# EAGLE design WaterLevelDisplay_v1-0 (EAGLE 9.0.1)
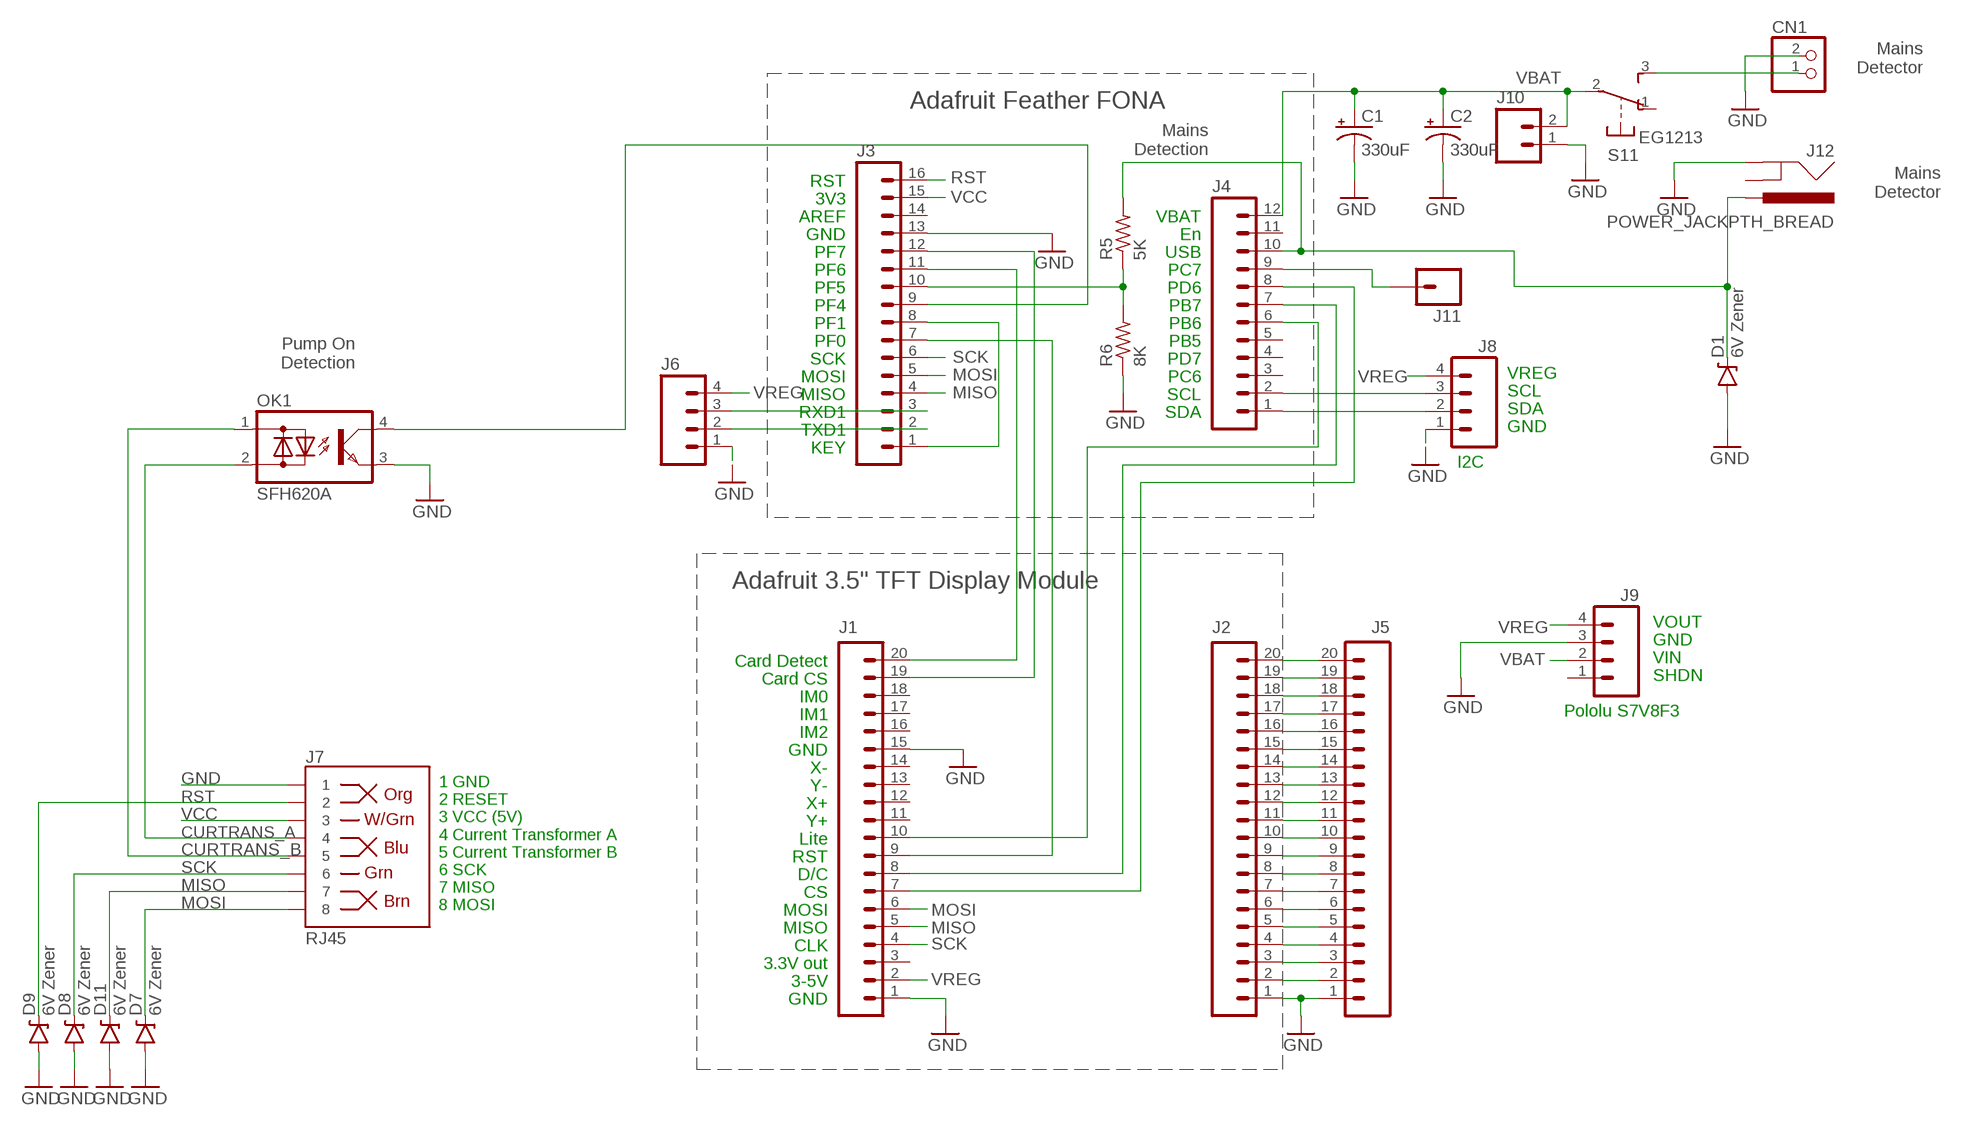
[diagram p0: schematic, sheet 1]

## Parts
C1  330uF  CAP_POLPTH1  [CPOL-RADIAL-100UF-25V]
C2  330uF  CAP_POLPTH1  [CPOL-RADIAL-100UF-25V]
CN1  JST_2PIN-SMT-RA  [JST-PH-2-SMT-RA]
D1  6V Zener  DIODE-ZENERPTH  [DIODE-ZENER]
D7  6V Zener  DIODE-ZENERPTH  [DIODE-ZENER]
D8  6V Zener  DIODE-ZENERPTH  [DIODE-ZENER]
D9  6V Zener  DIODE-ZENERPTH  [DIODE-ZENER]
D11  6V Zener  DIODE-ZENERPTH  [DIODE-ZENER]
J1  M20NOSILK  [1X20_NOSILK]
J2  M20NOSILK  [1X20_NOSILK]
J3  M161X16_NO_SILK  [1X16_NO_SILK]
J4  M12NO_SILK  [1X12_NO_SILK]
J5  M20NOSILK  [1X20_NOSILK]
J6  M04PTH  [1X04]
J7  RJ45  RJ45-8PTH  [RJ45-8]
J8  M04PTH  [1X04]
J9  M04PTH  [1X04]
J10  M02PTH  [1X02]
J11  M01PTH  [1X01]
J12  POWER_JACKPTH_BREAD  [POWER_JACK_PTH_BREAD]
OK1  SFH620A  [DIL04]
R5  5K  R-US_0204/5  [0204/5]
R6  8K  R-US_0204/5  [0204/5]
S1  EG1213  [EG1213]

## Nets
CURTRANS_A: J7.4 OK1.2(AC2)
CURTRANS_B: J7.5 OK1.1(AC1)
GND: C1.2(-) C2.2(-) CN1.2 D1.P$2(A) D7.P$2(A) D8.P$2(A) D9.P$2(A) D11.P$2(A) J1.1 J1.15 J2.1 J3.13 J5.1 J6.1 J7.1 J8.1 J9.3 J10.1 J12.GND OK1.3(E) R6.1
MISO: D11.P$1(C) J1.5 J3.4 J7.7
MOSI: D7.P$1(C) J1.6 J3.5 J7.8
N$1: CN1.1 S1.3(1:S)
N$2: J2.2 J5.2
N$3: J2.3 J5.3
N$4: J2.4 J5.4
N$5: J2.5 J5.5
N$6: J3.3 J6.3
N$7: J2.6 J5.6
N$8: J2.7 J5.7
N$9: J4.9 J11.1
N$10: J2.8 J5.8
N$11: J2.9 J5.9
N$12: J2.10 J5.10
N$13: J2.11 J5.11
N$14: J2.12 J5.12
N$15: J3.1 J3.8
N$16: J2.13 J5.13
N$17: D1.P$1(C) J4.10 J12.PWR R5.2
N$18: J3.10 R5.1 R6.2
N$19: J2.14 J5.14
N$20: J2.15 J5.15
N$21: J2.16 J5.16
N$22: J2.17 J5.17
N$23: J2.18 J5.18
N$24: J2.19 J5.19
N$25: J2.20 J5.20
N$26: J3.2 J6.2
N$27: J1.8 J4.7
N$28: J1.19 J3.12
N$29: J1.20 J3.11
N$30: J1.10 J4.6
N$31: J3.9 OK1.4(C)
N$32: J1.7 J4.8
N$33: J1.9 J3.7
N$34: J4.1 J8.2
N$35: J4.2 J8.3
RST: D9.P$1(C) J3.16 J7.2
SCK: D8.P$1(C) J1.4 J3.6 J7.6
VBAT: C1.1(+) C2.1(+) J4.12 J9.2 J10.2 S1.2(1:P)
VCC: J3.15 J7.3
VREG: J1.2 J6.4 J8.4 J9.4
Unconnected: J1.3 J1.11 J1.12 J1.13 J1.14 J1.16 J1.17 J1.18 J3.14 J4.3 J4.4 J4.5 J4.11 J9.1 J12.GNDBREAK S1.1(1:O) S1.MT1(MT) S1.MT2(MT)

## Notes on the sheet
- Mains
  Detector
- Adafruit Feather FONA
- Mains
  Detection
- RST
- Mains
  Detector
- 3V3
- AREF | VBAT
- GND | En
- PF7 | USB
- PF6 | PC7
- PF5 | PD6
- PF4 | PB7
- PF1 | PB6
- PF0 | PB5
- SCK | PD7
- Pump On
  Detection
- MOSI | PC6 | VREG
- MISO | SCL | SCL
- RXD1 | SDA | SDA
- TXD1 | GND
- KEY
- I2C
- Adafruit 3.5" TFT Display Module
- VOUT
- GND
- Card Detect | VIN
- Card CS | SHDN
- IM0
- IM1 | Pololu S7V8F3
- IM2
- GND
- X-
- 1 GND
  2 RESET
  3 VCC (5V)
  4 Current Transformer A
  5 Current Transformer B
  6 SCK
  7 MISO
  8 MOSI
- Y-
- X+
- Y+
- Lite
- RST
- D/C
- CS
- MOSI
- MISO
- CLK
- 3.3V out
- 3-5V
- GND

## Library data of the parts
C1 C2 = SparkFun-Capacitors:CAP_POL: Capacitor Polarized These are standard SMD and PTH capacitors. Normally 10uF, 47uF, and 100uF in electrolytic and tantalum varieties. Always verify the external diameter of the through hole cap, it varies with capacity, voltage, and manufacturer. The EIA devices should be standard.
CN1 = adafruit:JST_2PIN: JST 2-Pin Connectors of various flavors SMT-RA (S2B-PH-SM4) 4UConnector #17311 SMT (B2B-PH-SM4) THM-RA (S2B-PH) THM (B2B-PH)
D1 D7-D9 D11 = SparkFun-DiscreteSemi:DIODE-ZENER: Zener Diode Production Part - 8199 3.4V Zener Voltage
J1 J2 J5 = SparkFun-Connectors:M20: 1x20 .1" header This is just like the LOCK variant in that the holes are staggared by 5 mil, but except for the last two holes. They are not altered from the "standard" footprint layout. This is used for a special purpose on the layout of our Graphic LCD Backpack. Make sure you want to use this device before selecting it for you project!
J3 = SparkFun-Connectors:M16: 1x16 .1" header
J4 = SparkFun-Connectors:M12: Header 12 Standard 12-pin 0.1" header. Use with straight break away headers (SKU : PRT-00116), right angle break away headers (PRT-00553), swiss pins (PRT-00743), machine pins (PRT-00117), and female headers (PRT-00115).
J6 J8 J9 = SparkFun-Connectors:M04: Header 4 Standard 4-pin 0.1" header. Use with straight break away headers (SKU : PRT-00116), right angle break away headers (PRT-00553), swiss pins (PRT-00743), machine pins (PRT-00117), and female headers (PRT-00115). Molex polarized connector foot print use with SKU : PRT-08231 with associated crimp pins and housings. 1MM SMD Version SKU: PRT-10208; PROD_ID: CONN-09696
J7 = SparkFun-Connectors:RJ45-8: RJ45 Jack Simple RJ45, 8-pin connection - connector for common Cat5, Cat5e, and Cat6 Ethernet cables. Footprint not yet proven in production. Connector sku is PRT-00643; Breakout PCB sku is BOB-00716.; PROD_ID: CONN-08506
J10 = SparkFun-Connectors:M02: Standard 2-pin 0.1" header. Use with - straight break away headers ( PRT-00116) - right angle break away headers (PRT-00553) - swiss pins (PRT-00743) - machine pins (PRT-00117) - female headers (PRT-00115) Molex polarized connector foot print use with: PRT-08233 with associated crimp pins and housings. 2.54_SCREWTERM for use with PRT-10571. 3.5mm Screw Terminal footprints for PRT-08084 5mm Screw Terminal footprints for use with PRT-08432
J11 = SparkFun-Connectors:M01: Header 1 Standard 1-pin 0.1" header. Use with straight break away headers (SKU : PRT-00116), right angle break away headers (PRT-00553), swiss pins (PRT-00743), machine pins (PRT-00117), and female headers (PRT-00115). SMTSO-256-ET is a "flush mount" nut for a 4-40 screw. The older package used to be too tight, and did not allow it to sit properly thru the drill hit. The latest (0.165DIA) fits nice and snug.
J12 = SparkFun-Connectors:POWER_JACK: Power Jack This is the standard 5.5mm barrel jack for power. The PTH is the most common, proven, reliable, footprint. The Slot footprint only works if the mill layer is transmitted to the PCB fab house so be warned. Mating wall wart : TOL-00298 (and others); PROD_ID: PRT-10811
OK1 = optocoupler:SFH620: Optocoupler, Phototransistor Output, AC Input Source: http://www.vishay.com/docs/83675/sfh620.pdf; MPN: SFH620A-2; OC_FARNELL: 1469594; OC_NEWARK: 97K9546
R5 R6 = resistor:R-US_: RESISTOR, American symbol
S1 = adafruit:EG1213: E-Switch right-angle slide SPDT Part #EG1213 http://www.ladyada.net/library/eagle

## Board
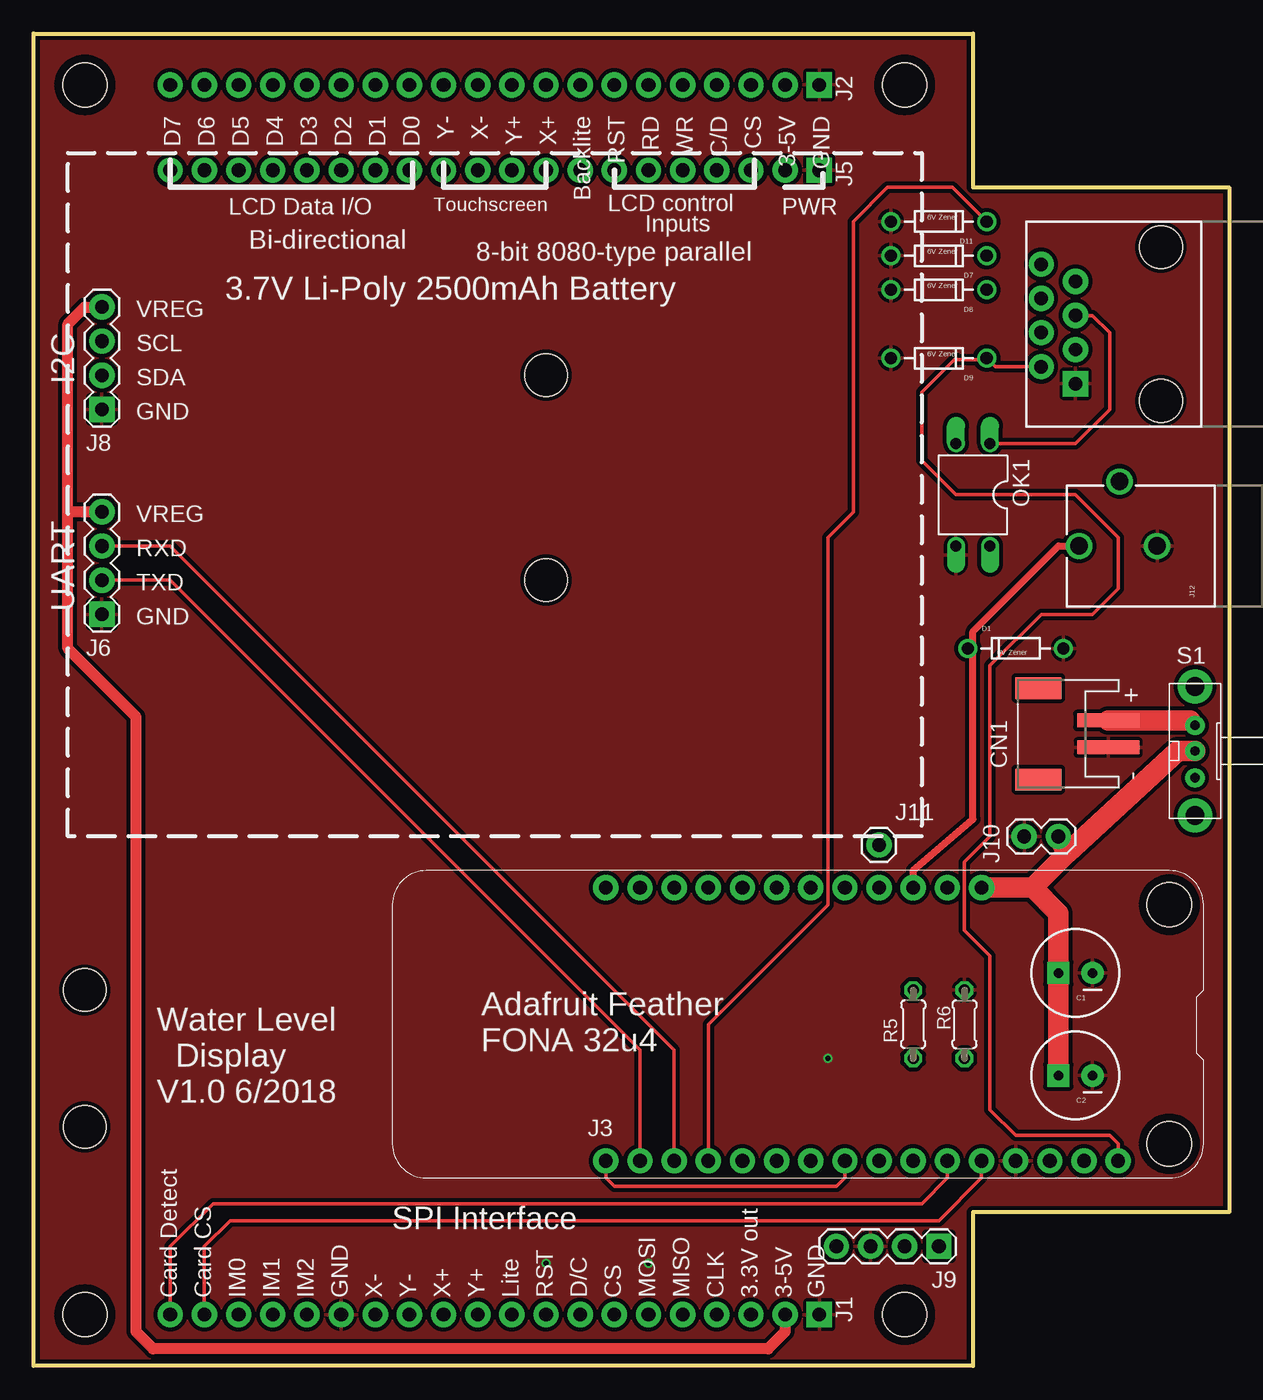
[diagram p1: board, top side]
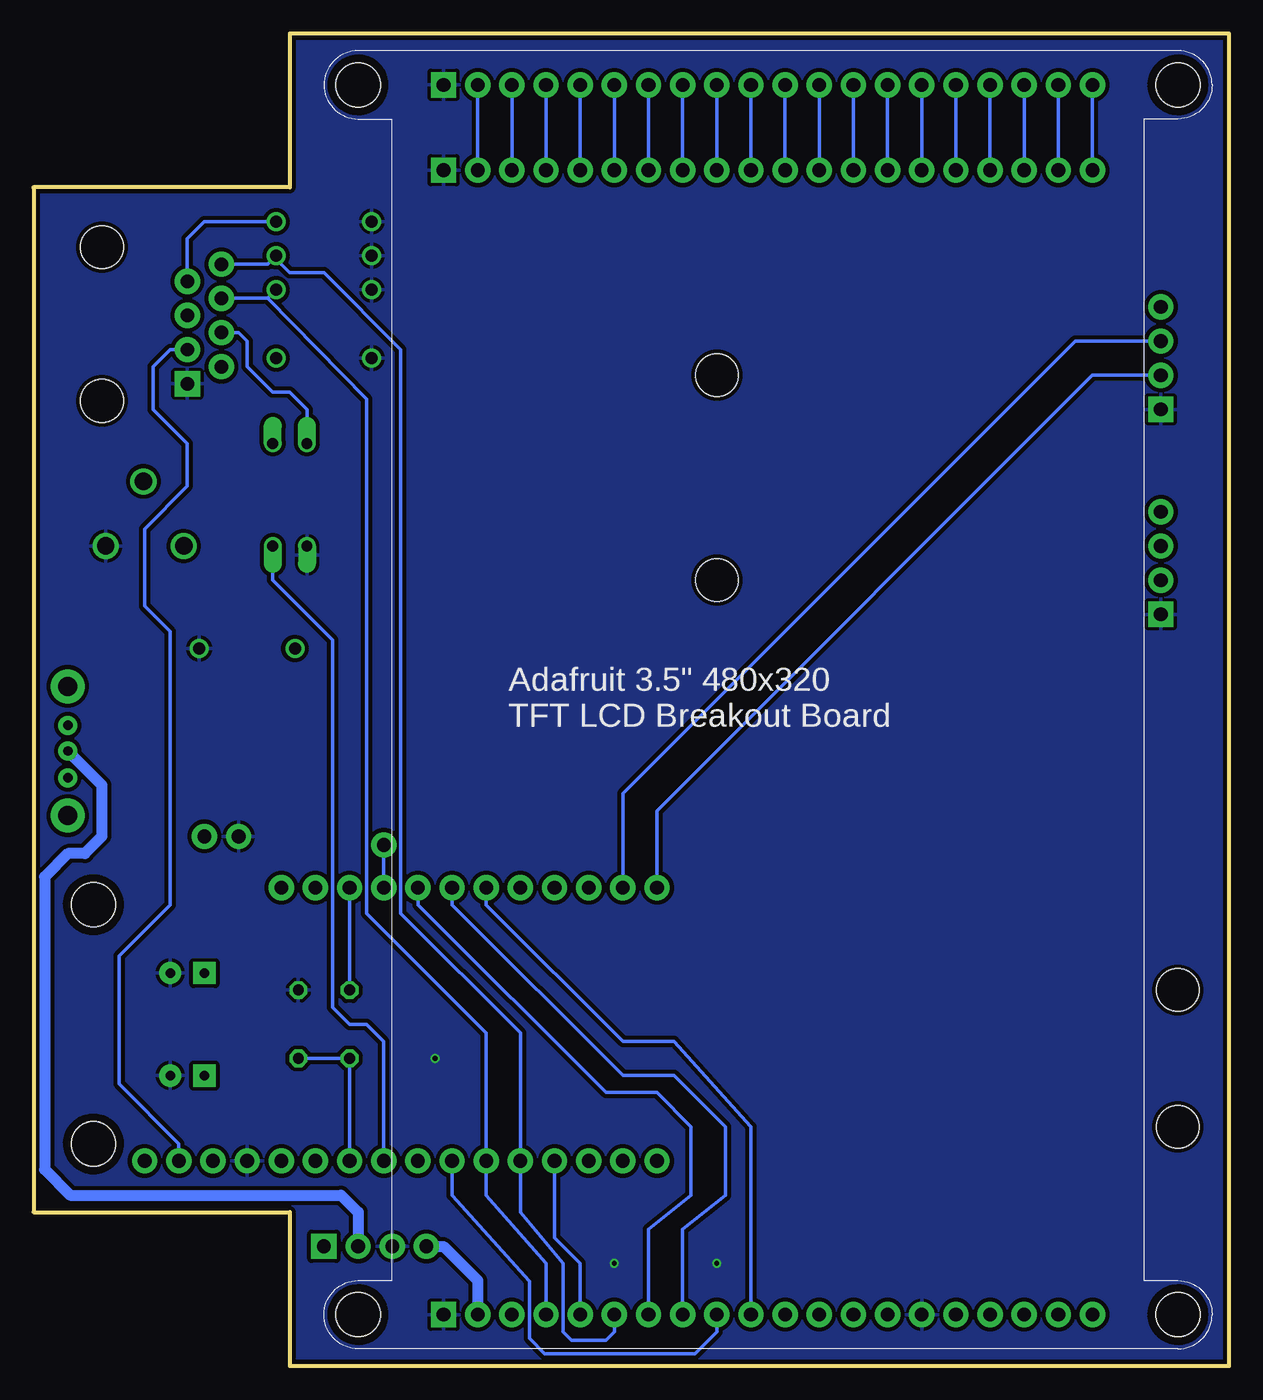
[diagram p2: board, bottom side, seen from below]

Size 88.9 x 99.06 mm. Coordinates in mm from the lower left corner, seen from the top.
Outline: 0,99.06 69.85,99.06 69.85,87.63 88.9,87.63 88.9,11.43 69.85,11.43 69.85,0 0,0 0,99.06
Copper layers (1*16): Top 0.035mm / dielectric 1.5mm / Bottom 0.035mm
Design rules "SeeedStudio_2layer_DRU_no_angle_20140221": minimum track width 6mil, minimum drill 12mil, track to track 6mil, track to pad 6mil, pad to pad 6mil, via to via 6mil, smd to smd 0mil, copper to edge 10mil, drill to drill 10mil, minimum pad ring 10mil, minimum via ring 6mil, stop-mask expansion 2mil, vias tented up to drill 100mil, thermal gap 10mil
Holes 3.17 mm at 3.81,27.94 3.81,17.78 38.1,73.66 38.1,58.42

### Footprints (pad centres in the part's own frame; a part is rotated, then mirrored left to right if it is on the bottom)
CPOL-RADIAL-100UF-25V = drill 0.7 pad 1.651 square: 1 1.27,0 | drill 0.7 pad 1.651: 2 -1.27,0
JST-PH-2-SMT-RA = smd 1 x 4.6: 1 1,-3.7; 2 -1,-3.7 | smd 1.6 x 3.4: NC1 -3.4,1.5; NC2 3.4,1.5
DIODE-ZENER = drill 0.9: P$1 -3.556,0; P$2 3.556,0
1X20_NOSILK = drill 1.016 pad 1.88 square: 1 0,0 | drill 1.016 pad 1.88: 2 2.54,0; 3 5.08,0; 4 7.62,0; 5 10.16,0; 6 12.7,0; 7 15.24,0; 8 17.78,0; 9 20.32,0; 10 22.86,0; 11 25.4,0; 12 27.94,0; 13 30.48,0; 14 33.02,0; 15 35.56,0; 16 38.1,0; 17 40.64,0; 18 43.18,0; 19 45.72,0; 20 48.26,0
1X16_NO_SILK = drill 1.016 pad 1.88: 1 0,0; 2 2.54,0; 3 5.08,0; 4 7.62,0; 5 10.16,0; 6 12.7,0; 7 15.24,0; 8 17.78,0; 9 20.32,0; 10 22.86,0; 11 25.4,0; 12 27.94,0; 13 30.48,0; 14 33.02,0; 15 35.56,0; 16 38.1,0
1X12_NO_SILK = drill 1.016 pad 1.88: 1 0,0; 2 2.54,0; 3 5.08,0; 4 7.62,0; 5 10.16,0; 6 12.7,0; 7 15.24,0; 8 17.78,0; 9 20.32,0; 10 22.86,0; 11 25.4,0; 12 27.94,0
1X04 = drill 1.016 pad 1.88 square: 1 0,0 | drill 1.016 pad 1.88: 2 2.54,0; 3 5.08,0; 4 7.62,0
RJ45-8 = drill 1 pad 1.88 square: 1 -4.445,6.35 | drill 1 pad 1.88: 2 -3.175,8.89; 3 -1.905,6.35; 4 -0.635,8.89; 5 0.635,6.35; 6 1.905,8.89; 7 3.175,6.35; 8 4.445,8.89 | hole 3.2: -5.715,0; 5.715,0
1X02 = drill 1.016 pad 1.88: 1 0,0; 2 2.54,0
1X01 = drill 1.016 pad 1.88: 1 0,0
POWER_JACK_PTH_BREAD = drill 1.3: GND 0,7.9; GNDBREAK 4.8,10.7; PWR 0,13.7
DIL04 = drill 0.813 offset: 1 -1.27,-3.81; 2 1.27,-3.81; 3 1.27,3.81; 4 -1.27,3.81
0204/5 = drill 0.813 octagon: 1 -2.54,0; 2 2.54,0
EG1213 = drill 0.7 pad 1.422: 1 -2,0; 2 0,0; 3 1.9,0 | drill 1.4 pad 2.54: MT1 -4.8,0; MT2 4.8,0
STAND-OFF = hole 3.302: 0,0

### Placement (x,y rotation side)
C1  77.47,29.21 180 top
C2  77.47,21.59 180 top
CN1  76.2,46.99 90 top
D1  73.03,53.34 0 top
D7  67.31,82.55 180 top
D8  67.31,80.01 180 top
D9  67.31,74.93 180 top
D11  67.31,85.09 180 top
J1  58.42,3.81 180 top
J2  58.42,95.25 180 top
J3  42.55,15.24 0 top
J4  42.55,35.56 0 top
J5  58.42,88.9 180 top
J6  5.08,55.88 90 top
J7  83.82,77.47 90 top
J8  5.08,71.12 90 top
J9  67.31,8.89 180 top
J10  73.66,39.37 0 top
J11  62.87,38.73 0 top
J12  91.44,60.96 90 top
OK1  69.85,64.77 180 top
R5  65.41,25.4 90 top
R6  69.22,25.4 270 top
S1  86.36,45.72 90 top
U$1  [STAND-OFF]  64.77,3.81 0 top
U$2  [STAND-OFF]  84.45,34.29 90 top
U$3  [STAND-OFF]  3.81,95.25 0 top
U$4  [STAND-OFF]  84.45,16.51 90 top
U$5  [STAND-OFF]  64.77,95.25 0 top
U$6  [STAND-OFF]  3.81,3.81 0 top

### Tracks (layer width: path | path; a pad name or v marks a point on that pad's centre or on a via)
CURTRANS_A
  Bottom 0.254: OK1.2 68.58,71.12 69.85,72.39 71.12,72.39 73.03,74.3 73.03,76.2 73.66,76.83 J7.4
CURTRANS_B
  Top 0.254: OK1.1 77.47,68.58 80.01,71.12 80.01,76.83 78.74,78.11 J7.5
GND  (via drill 0.35)
  other vias: 59.05,22.86 38.1,7.62 45.72,7.62
  pour Top (isolate 0.305): 0,99.06 69.85,99.06 69.85,87.63 88.9,87.63 88.9,11.43 69.85,11.43 69.85,0 0,0
  pour Bottom (isolate 0.305): 0,99.06 69.85,99.06 69.85,87.63 88.9,87.63 88.9,11.43 69.85,11.43 69.85,0 0,0
MISO
  Top 0.254: D11.P$1 68.33,87.63 63.5,87.63 60.96,85.09 60.96,63.5 59.05,61.59 59.05,34.29 50.16,25.4 J3.4
  Bottom 0.254: J1.5 48.26,7.62 50.16,9.53 J3.4 | D11.P$1 76.2,85.09 77.47,83.82 J7.7
MOSI
  Bottom 0.254: J1.6 45.72,2.54 46.35,1.91 48.9,1.91 49.53,2.54 49.53,7.62 52.7,11.43 J3.5 52.7,24.77 61.59,33.66 61.59,75.56 67.31,81.28 69.85,81.28 70.87,82.3 D7.P$1 71.5,81.92 J7.8
N$1
  Top 1.27: 85.99,47.99 S1.3
  Top 1.524: CN1.1 85.99,47.99
N$2
  Bottom 0.254: J2.2 J5.2
N$3
  Bottom 0.254: J2.3 J5.3
N$4
  Bottom 0.254: J2.4 J5.4
N$5
  Bottom 0.254: J2.5 J5.5
N$6
  Top 0.254: J6.3 10.16,60.96 47.62,23.5 J3.3
N$7
  Bottom 0.254: J2.6 J5.6
N$8
  Bottom 0.254: J2.7 J5.7
N$9
  Bottom 0.254: J11.1 J4.9
N$10
  Bottom 0.254: J2.8 J5.8
N$11
  Bottom 0.254: J2.9 J5.9
N$12
  Bottom 0.254: J2.10 J5.10
N$13
  Bottom 0.254: J2.11 J5.11
N$14
  Bottom 0.254: J2.12 J5.12
N$15
  Top 0.254: J3.1 42.55,13.97 43.18,13.34 59.69,13.34 60.33,13.97 J3.8
N$16
  Bottom 0.254: J2.13 J5.13
N$17
  Top 0.508: J4.10 65.41,36.83 69.85,40.64 69.85,53.34 | 69.85,53.34 69.85,54.61 76.2,60.96 J12.PWR | D1.P$1 69.85,53.34
  Bottom 0.254: R5.2 J4.10
N$18
  Bottom 0.254: R6.2 R5.1 J3.10
N$19
  Bottom 0.254: J2.14 J5.14
N$20
  Bottom 0.254: J2.15 J5.15
N$21
  Bottom 0.254: J2.16 J5.16
N$22
  Bottom 0.254: J2.17 J5.17
N$23
  Bottom 0.254: J2.18 J5.18
N$24
  Bottom 0.254: J2.19 J5.19
N$25
  Bottom 0.254: J2.20 J5.20
N$26
  Top 0.254: J6.2 10.16,58.42 45.09,23.5 J3.2
N$27
  Bottom 0.254: J4.7 57.78,34.29 45.09,21.59 41.27,21.59 37.47,17.78 37.47,12.7 40.64,10.16 J1.8
N$28
  Top 0.254: J3.12 70.48,13.97 67.31,10.79 14.61,10.79 12.7,8.89 J1.19
N$29
  Top 0.254: J3.11 67.94,13.97 66.04,12.06 13.34,12.06 10.16,8.89 J1.20
N$30
  Bottom 0.254: J1.10 35.56,17.78 41.27,24.13 45.09,24.13 55.24,34.29 J4.6
N$31
  Bottom 0.254: J3.9 62.87,24.13 64.14,25.4 65.41,25.4 66.67,26.67 66.67,53.98 71.12,58.42 OK1.4
N$32
  Bottom 0.254: J1.7 43.18,10.16 40.01,12.7 40.01,17.78 42.55,20.32 46.35,20.32 60.33,34.29 J4.8
N$33
  Bottom 0.254: J3.7 57.78,12.7 52.02,6.3 52.02,2.04 50.9,0.91 39.73,0.91 38.1,2.54 J1.9
N$34
  Bottom 0.254: J8.2 10.16,73.66 42.55,41.27 J4.1
N$35
  Bottom 0.254: J8.3 11.43,76.2 45.09,42.55 J4.2
RST
  Top 0.254: J7.2 71.5,74.3 70.99,74.8 | 70.99,74.8 D9.P$1 | 70.99,74.8 68.71,74.8 68.58,74.93 66.04,72.39 66.04,67.31 68.58,64.77 77.47,64.77 80.64,61.59 80.64,57.78 78.74,55.88 74.93,55.88 71.12,52.07 71.12,39.37 69.22,37.47 69.22,32.38 71.12,30.48 71.12,19.05 73.03,17.14 80.01,17.14 80.64,16.51 J3.16
SCK
  Bottom 0.254: J1.4 50.8,7.62 55.24,12.7 J3.6 55.24,24.77 64.14,33.66 64.14,71.87 71.5,79.38 | 70.87,79.76 D8.P$1 71.5,79.38 | 71.5,79.38 J7.6
VBAT
  Top 1.524: S1.2 85.09,45.72 76.83,38.1 | 76.83,38.1 74.3,35.56 | 74.3,35.56 J4.12 | J10.2 76.83,38.1 | C2.1 C1.1 76.2,33.66 74.3,35.56
  Bottom 0.813: S1.2 83.82,43.18 83.82,39.37 85.09,38.1 86.36,38.1 88.09,36.37 88.09,14.61 86.18,12.7 66.04,12.7 64.77,11.43 J9.2
VCC
  Bottom 0.254: J7.3 78.74,75.56 80.01,74.3 80.01,71.12 77.47,68.58 77.47,65.41 80.64,62.23 80.64,56.52 78.74,54.61 78.74,34.29 82.55,30.48 82.55,20.95 78.11,16.51 J3.15
VREG
  Top 0.813: J1.2 55.88,2.54 54.61,1.27 8.89,1.27 7.62,2.54 7.62,48.26 2.54,53.34 2.54,63.5 | 2.54,63.5 2.54,77.47 3.81,78.74 J8.4 | J6.4 2.54,63.5
  Bottom 0.813: J9.4 58.42,8.89 55.88,6.35 J1.2

### Text on the board
tPlace: D7 | D6 | D5 | D4 | D3 | D2 | D1 | D0 | Y- | X- | Y+ | X+ | Backlite | RST | RD | WR | C/D | CS | 3-5V | GND | LCD Data I/O | Touchscreen | LCD control | PWR | Inputs | Bi-directional | 8-bit 8080-type parallel | 3.7V Li-Poly 2500mAh Battery | VREG | I2C | SCL | SDA | GND | UART | VREG | RXD | TXD | GND | Adafruit Feather / FONA 32u4 | Water Level / Display / V1.0 6/2018 | SPI Interface | Card Detect | Card CS | IM0 | IM1 | IM2 | GND | X- | Y- | X+ | Y+ | Lite | RST | D/C | CS | MOSI | MISO | CLK | 3.3V out | 3-5V | GND
bPlace: Adafruit 3.5" 480x320 / TFT LCD Breakout Board